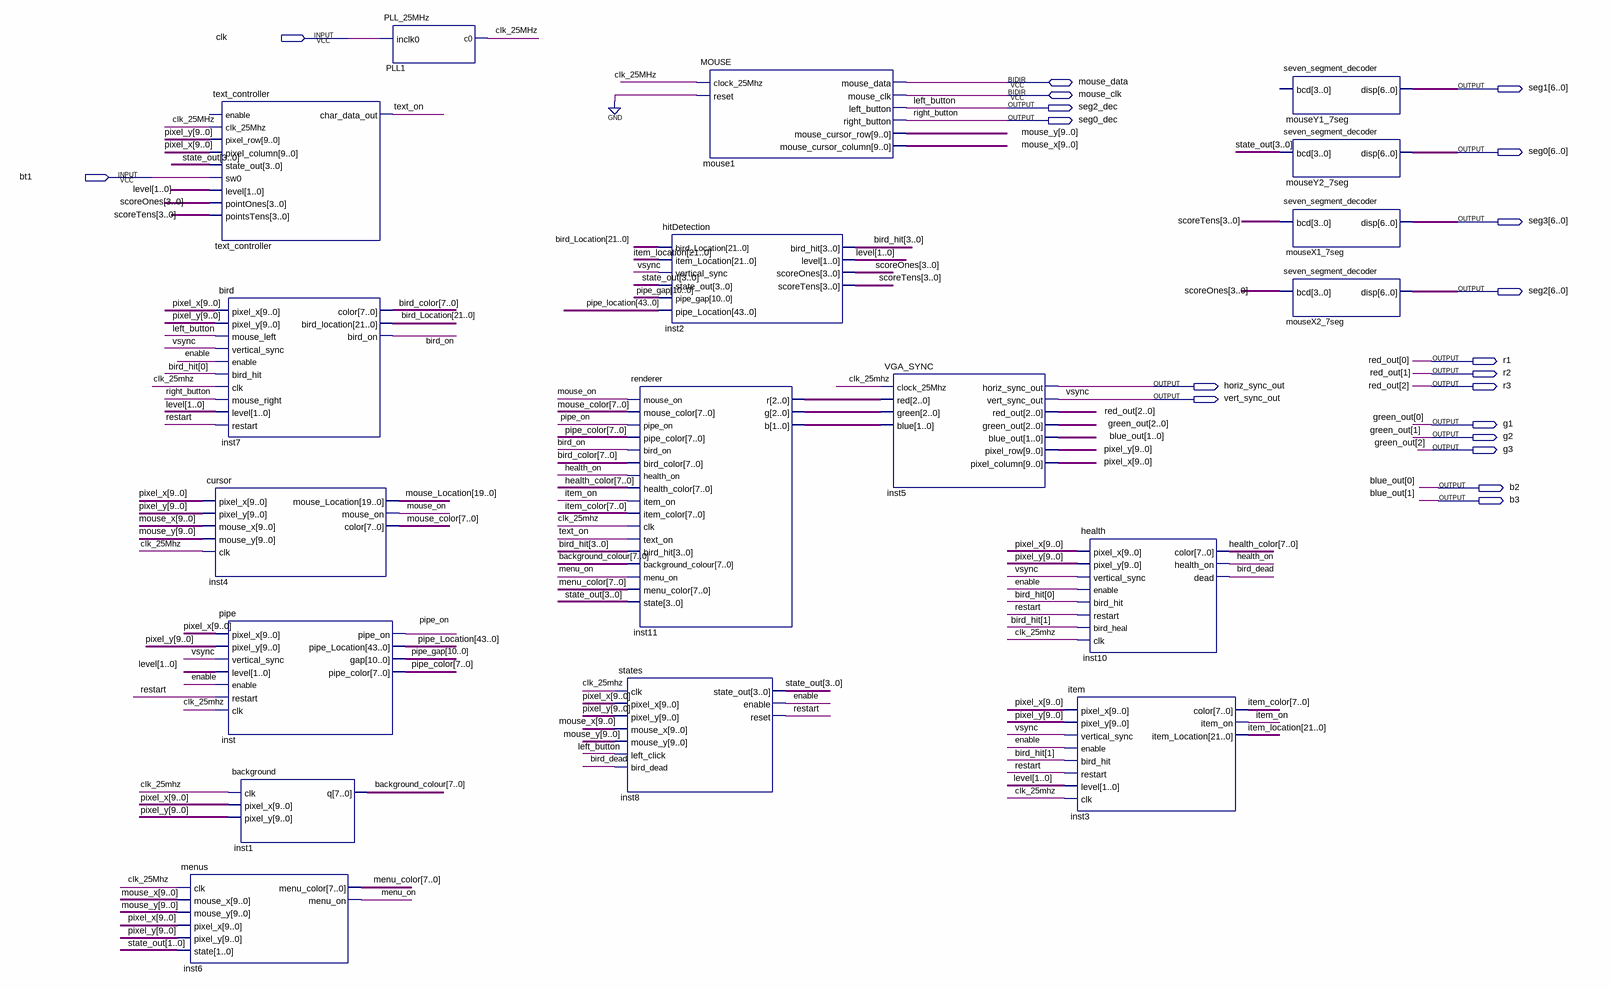
[diagram p0: schematic sheet]
// Quartus schematic part1_Demo.bdf as structural Verilog: 18 symbols, 20 pins
module part1_Demo (
  input  clk,
  input  bt1,
  inout  mouse_data,
  inout  mouse_clk,
  output [6:0] seg1,
  output seg2_dec,
  output seg0_dec,
  output [6:0] seg0,
  output [6:0] seg3,
  output [6:0] seg2,
  output r1,
  output r2,
  output horiz_sync_out,
  output r3,
  output vert_sync_out,
  output g1,
  output g2,
  output g3,
  output b2,
  output b3
);

  wire bird_dead, bird_on, clk_25MHz, enable, health_on, item_on, menu_on, mouse_on, pipe_on, restart,
       text_on;
  wire [1:0] inst11_b, level;
  wire [2:0] inst11_g, inst11_r;
  wire [3:0] bird_hit, scoreOnes, scoreTens, state_out;
  wire [7:0] background_colour, bird_color, health_color, item_color, menu_color, mouse_color, pipe_color;
  wire [9:0] mouse_x, mouse_y, pixel_x, pixel_y;
  wire [10:0] pipe_gap;
  wire [19:0] mouse_Location;
  wire [21:0] bird_Location, item_location;
  wire [43:0] pipe_location;

  text_controller text_controller (
    .clk_25Mhz(clk_25MHz), .pixel_row(pixel_y), .pixel_column(pixel_x), .state_out(state_out), .sw0(bt1),
    .level(level), .pointOnes(scoreOnes), .pointsTens(scoreTens), .char_data_out(text_on));  // open: enable
  bird inst7 (
    .pixel_x(pixel_x), .pixel_y(pixel_y), .mouse_left(seg2_dec), .vertical_sync(vert_sync_out),
    .enable(enable), .bird_hit(bird_hit[0]), .clk(clk_25MHz), .mouse_right(seg0_dec), .level(level),
    .restart(restart), .color(bird_color), .bird_location(bird_Location), .bird_on(bird_on));
  cursor inst4 (
    .pixel_x(pixel_x), .pixel_y(pixel_y), .mouse_x(mouse_x), .mouse_y(mouse_y), .clk(clk_25MHz),
    .mouse_Location(mouse_Location), .mouse_on(mouse_on), .color(mouse_color));
  pipe inst (
    .pixel_x(pixel_x), .pixel_y(pixel_y), .vertical_sync(vert_sync_out), .level(level), .enable(enable),
    .restart(restart), .clk(clk_25MHz), .pipe_on(pipe_on), .pipe_Location(pipe_location), .gap(pipe_gap),
    .pipe_color(pipe_color));
  menus inst6 (
    .clk(clk_25MHz), .mouse_x(mouse_x), .mouse_y(mouse_y), .pixel_x(pixel_x), .pixel_y(pixel_y),
    .state(state_out[1:0]), .menu_color(menu_color), .menu_on(menu_on));
  background inst1 (.clk(clk_25MHz), .pixel_x(pixel_x), .pixel_y(pixel_y), .q(background_colour));
  PLL_25MHz PLL1 (.inclk0(clk), .c0(clk_25MHz));
  states inst8 (
    .clk(clk_25MHz), .pixel_x(pixel_x), .pixel_y(pixel_y), .mouse_x(mouse_x), .mouse_y(mouse_y),
    .left_click(seg2_dec), .bird_dead(bird_dead), .state_out(state_out), .enable(enable), .reset(restart));
  hitDetection inst2 (
    .bird_Location(bird_Location), .item_Location(item_location), .vertical_sync(vert_sync_out),
    .state_out(state_out), .pipe_gap(pipe_gap), .pipe_Location(pipe_location), .bird_hit(bird_hit),
    .level(level), .scoreOnes(scoreOnes), .scoreTens(scoreTens));
  renderer inst11 (
    .mouse_on(mouse_on), .mouse_color(mouse_color), .pipe_on(pipe_on), .pipe_color(pipe_color),
    .bird_on(bird_on), .bird_color(bird_color), .health_on(health_on), .health_color(health_color),
    .item_on(item_on), .item_color(item_color), .clk(clk_25MHz), .text_on(text_on), .bird_hit(bird_hit),
    .background_colour(background_colour), .menu_on(menu_on), .menu_color(menu_color), .state(state_out),
    .r(inst11_r), .g(inst11_g), .b(inst11_b));
  MOUSE mouse1 (
    .clock_25Mhz(clk_25MHz), .reset(1'b0), .left_button(seg2_dec), .right_button(seg0_dec),
    .mouse_cursor_row(mouse_y), .mouse_cursor_column(mouse_x), .mouse_data(mouse_data), .mouse_clk(mouse_clk));
  VGA_SYNC inst5 (
    .clock_25Mhz(clk_25MHz), .red(inst11_r), .green(inst11_g), .blue(inst11_b),
    .horiz_sync_out(horiz_sync_out), .vert_sync_out(vert_sync_out), .red_out({r3, r2, r1}),
    .green_out({g3, g2, g1}), .blue_out({b3, b2}), .pixel_row(pixel_y), .pixel_column(pixel_x));
  health inst10 (
    .pixel_x(pixel_x), .pixel_y(pixel_y), .vertical_sync(vert_sync_out), .enable(enable),
    .bird_hit(bird_hit[0]), .restart(restart), .bird_heal(bird_hit[1]), .clk(clk_25MHz),
    .color(health_color), .health_on(health_on), .dead(bird_dead));
  item inst3 (
    .pixel_x(pixel_x), .pixel_y(pixel_y), .vertical_sync(vert_sync_out), .enable(enable),
    .bird_hit(bird_hit[1]), .restart(restart), .level(level), .clk(clk_25MHz), .color(item_color),
    .item_on(item_on), .item_Location(item_location));
  seven_segment_decoder mouseY1_7seg (.disp(seg1));  // open: bcd
  seven_segment_decoder mouseY2_7seg (.bcd(state_out), .disp(seg0));
  seven_segment_decoder mouseX1_7seg (.bcd(scoreTens), .disp(seg3));
  seven_segment_decoder mouseX2_7seg (.bcd(scoreOnes), .disp(seg2));

  // Other names for the same wires on the sheet: blue_out[1:0] = {b3, b2}; green_out[2:0] = {g3, g2, g1};
  //   left_button = seg2_dec; red_out[2:0] = {r3, r2, r1}; right_button = seg0_dec; vsync = vert_sync_out
endmodule
